# EAGLE design SparkX-Pi-Filter (EAGLE 9.3.0)
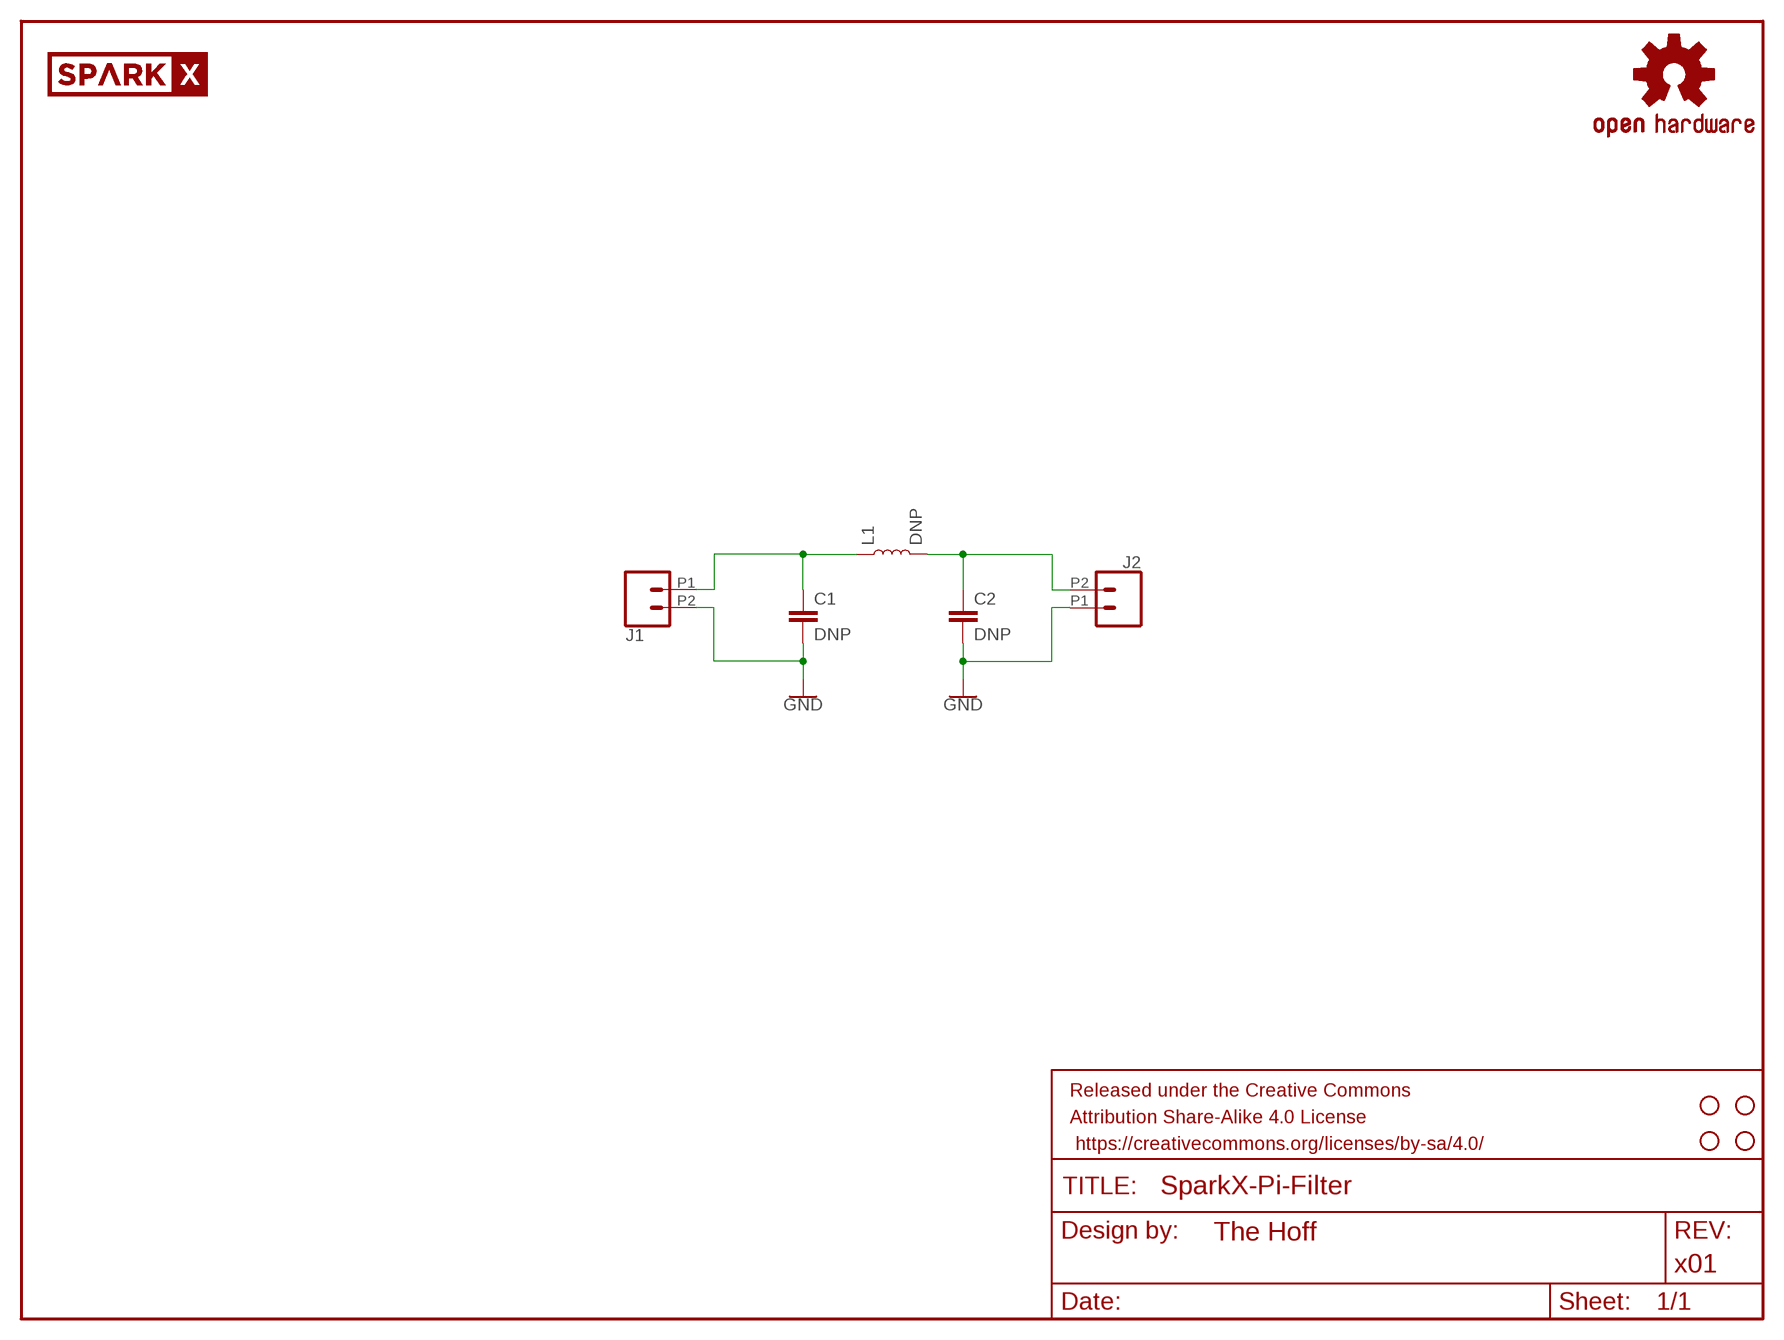
[diagram p0: schematic, sheet 1]

## Parts
C1  DNP  1.0UF-0805-25V-(+80/-20%)  [0805]
C2  DNP  1.0UF-0805-25V-(+80/-20%)  [0805]
FRAME1  FRAME-LETTER  [CREATIVE_COMMONS]
H1  STAND-OFF  [STAND-OFF]
H2  STAND-OFF  [STAND-OFF]
H3  STAND-OFF  [STAND-OFF]
H4  STAND-OFF  [STAND-OFF]
J1  CONN_022.54MM_SCREWTERM  [1X02_2.54_SCREWTERM]
J2  CONN_022.54MM_SCREWTERM  [1X02_2.54_SCREWTERM]
L1  DNP  INDUCTOR-0805-3.3UH  [0805]
LOGO1  OSHW-LOGOM  [OSHW-LOGO-M]
U$1  SPARKX-LOGO4  [SPARKX-MEDIUM]

## Nets
GND: C1.2 C2.2 J1.P2 J2.P1
N$1: C1.1 J1.P1 L1.1
N$2: C2.1 J2.P2 L1.2

## Library data of the parts
C1 C2 = SparkFun-Capacitors:1.0UF: 1µF ceramic capacitors A capacitor is a passive two-terminal electrical component used to store electrical energy temporarily in an electric field.; PROD_ID: CAP-11625; VALUE: 1.0uF
FRAME1 = SparkFun-Aesthetics:FRAME-LETTER: Schematic Frame - Letter Standard 8.5x11 US Letter frame; DESIGNER: The Hoff; REV: x01
H1-H4 = SparkFun-Hardware:STAND-OFF: Stand Off Drill holes for mechanically mounting via screws, standoffs, etc. Note: Use the keepout ring to avoid running the screw head into surrounding components. Variant Overviews STAND-OFF - Mechanical footprint for a #4 phillips button head screw. STAND-OFF-TIGHT - Mechanical footprint for a #4 phillips button head screw, Example SparkFun Products Screw - Phillips Head (1/4", 4-40, 10 pack) <https://www.sparkfun.com/products/10453> (PRT-10453) Screw - Phillips Head (1/2", 4-40, 10 pack) <https://www.sparkfun.com/products/10452> (PRT-10452) Screw - Phillips Head (3/4", 4-40, 10 pack) <https://www.sparkfun.com/products/10451> (PRT-10451) Screw - Phillips Head (1", 4-40, 10 pack) <https://www.sparkfun.com/products/10450> (PRT-10450)
J1 J2 = SparkFun-Connectors:CONN_02: Multi connection point. Often used as Generic Header-pin footprint for 0.1 inch spaced/style header connections On any of the 0.1 inch spaced packages, you can populate with these: Break Away Headers - Straight <https://www.sparkfun.com/products/116> (PRT-00116) Break Away Male Headers - Right Angle <https://www.sparkfun.com/products/553> (PRT-00553) Female Headers <https://www.sparkfun.com/products/115> (PRT-00115) Break Away Headers - Machine Pin <https://www.sparkfun.com/products/117> (PRT-00117) Break Away Female Headers - Swiss Machine Pin <https://www.sparkfun.com/products/743> (PRT-00743) For SCREWTERMINALS and SPRING TERMINALS visit here: Screw Terimnals on SparkFun.com <https://www.sparkfun.com/search/results?term=Screw+Terminals> (5mm/3.5mm/2.54mm spacing) This device is also useful as a general connection point to wire up your design to another part of your project. Our various solder wires solder well into these plated through hole pads. Hook-Up Wire - Assortment (Stranded, 22 AWG) <https://www.sparkfun.com/products/11375> (PRT-11375) Hook-Up Wire - Assortment (Solid Core, 22 AWG) <https://www.sparkfun.com/products/11367> (PRT-11367) View the entire wire category on our website here <https://www.sparkfun.com/categories/141> Special notes: Molex polarized connector foot print use with: PRT-08233 with associated crimp pins and housings. 2.54_SCREWTERM for use with PRT-10571. 3.5mm Screw Terminal footprints for PRT-08084 5mm Screw Terminal footprints for use with PRT-08432
L1 = SparkFun-Coils:INDUCTOR: Inductors Resist changes in electrical current. Basically a coil of wire. SparkFun Products: SparkFun Load Cell Amplifier - HX711 <https://www.sparkfun.com/products/13879> IOIO-OTG - V2.2 <https://www.sparkfun.com/products/13613>; PROD_ID: NDUC-13076; VALUE: 3.3µH/±20%/450mA
LOGO1 = SparkFun-Aesthetics:OSHW-LOGO: Open-Source Hardware (OSHW) Logo This logo indicates the piece of hardware it is found on incorporates a OSHW license and/or adheres to the definition of open source hardware found here: http://freedomdefined.org/OSHW
U$1 = SparkX:SPARKX-LOGO

## Board
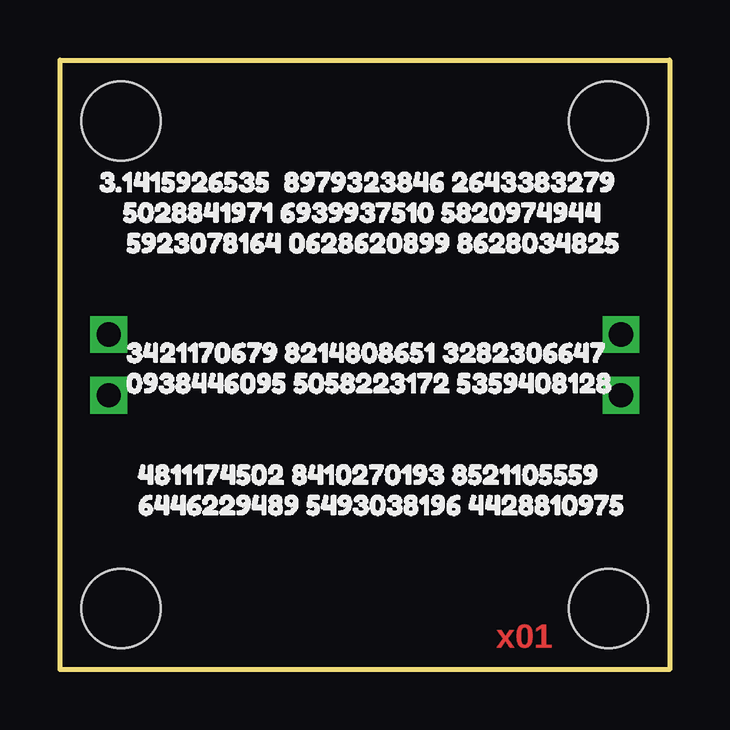
[diagram p1: board, top side]
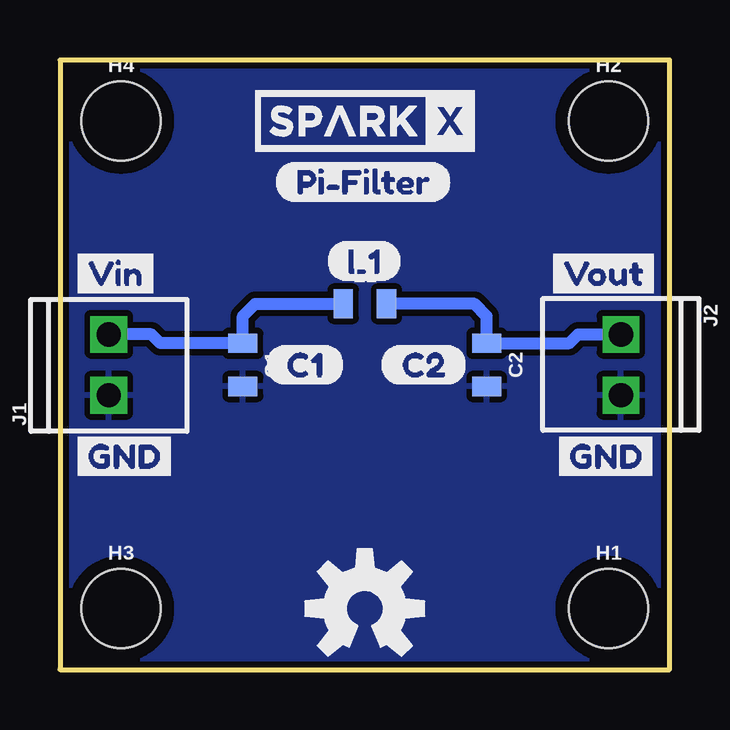
[diagram p2: board, bottom side, seen from below]

Size 25.4 x 25.4 mm. Coordinates in mm from the lower left corner, seen from the top.
Outline: 25.4,0 0,0 0,25.4 25.4,25.4 25.4,0
Copper layers (1*16): Top 0.035mm / dielectric 1.5mm / Bottom 0.035mm
Design rules "SparkFun-2-layer-PCBWay-LIMIT": minimum track width 6mil, minimum drill 0.3mm, track to track 6mil, track to pad 6mil, pad to pad 6mil, via to via 6mil, smd to smd 6mil, copper to edge 6mil, drill to drill 6mil, minimum pad ring 6mil, minimum via ring 6mil, stop-mask expansion 4mil, vias tented up to drill 25mil, thermal gap 10mil

### Footprints (pad centres in the part's own frame; a part is rotated, then mirrored left to right if it is on the bottom)
0805 = smd 0.8 x 1.2: 1 -0.9,0; 2 0.9,0
STAND-OFF = hole 3.302: 0,0
1X02_2.54_SCREWTERM = drill 1.016 square: P1 2.54,0; P2 0,0

### Placement (x,y rotation side)
C1  17.78,12.7 270 bottom
C2  7.62,12.7 270 bottom
FRAME1  34.29,-17.78 0 bottom  (outside the outline)
H1  2.54,2.54 0 bottom
H2  2.54,22.86 0 bottom
H3  22.86,2.54 0 bottom
H4  22.86,22.86 0 bottom
J1  23.37,11.43 90 bottom
J2  2.03,13.97 270 bottom
L1  12.7,15.24 0 bottom
LOGO1  12.7,2.54 0 bottom
U$1  12.7,22.86 0 bottom
U$2  [GND0]  5.08,8.89 0 bottom
U$3  [GND0]  25.15,8.89 0 bottom
U$4  [PI#FILTER3]  16.51,20.32 0 bottom
U$5  [VIN1]  25.15,16.51 0 bottom
U$6  [3#1415926535__8979323846_26433832790]  0.89,20.32 0 top
U$7  [5028841971_6939937510_58209749441]  1.91,19.05 0 top
U$8  [5923078164_0628620899_86280348252]  2.03,17.78 0 top
U$9  [3421170679_8214808651_32823066473]  2.03,13.21 0 top
U$10  [0938446095_5058223172_53594081284]  2.03,11.94 0 top
U$11  [4811174502_8410270193_85211055595]  2.54,8.13 0 top
U$12  [6446229489_5493038196_44288109756]  2.54,6.86 0 top
U$13  [VOUT2]  5.33,16.51 0 bottom
U$14  [C10]  16.89,12.7 0 bottom
U$15  [C21]  12.06,12.7 0 bottom
U$16  [L12]  14.35,17.02 0 bottom

### Tracks (layer width: path | path; a pad name or v marks a point on that pad's centre or on a via)
GND
  Bottom 0.508: C1.2 arc-90 17.92,11.94 | 22.86,11.94 J1.P2 | 2.4,11.8 J2.P1
  pour Bottom (isolate 0.254): 25.4,0 0,0 0,25.4 25.4,25.4
N$1
  Bottom 0.508: 17.92,13.46 arc-90 C1.1 | C1.1 21.22,13.6 21.59,13.97 J1.P1 | C1.1 17.78,14.73 17.27,15.24 L1.1
N$2
  Bottom 0.508: L1.2 8.13,15.24 7.62,14.73 C2.1 4.18,13.6 3.81,13.97 J2.P2

### Text on the board
Top: x01
bDocu: The Hoff